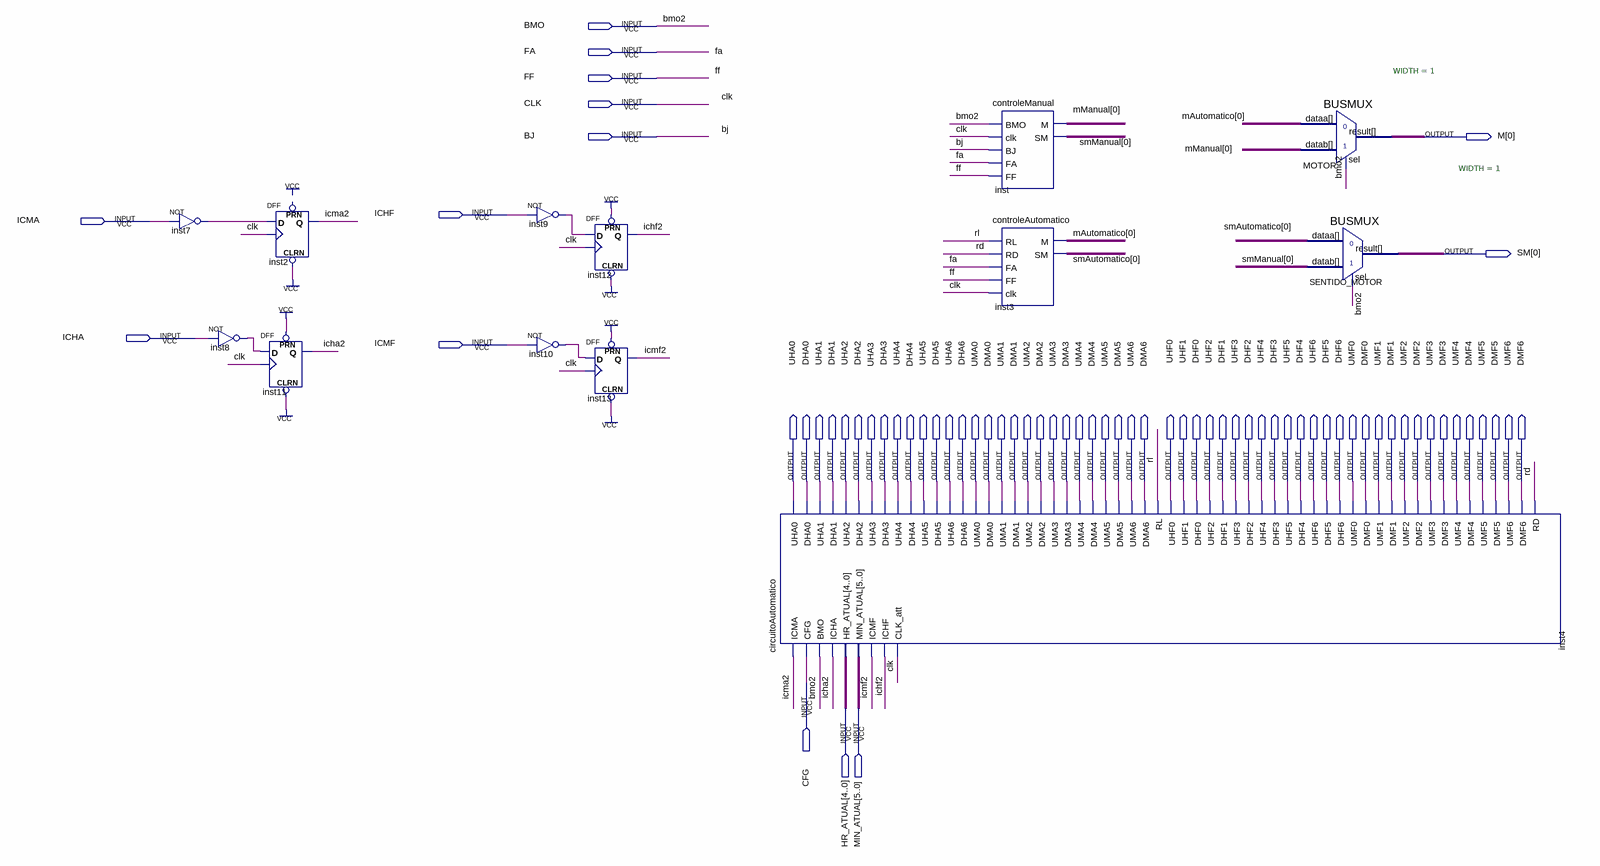
[diagram p0: schematic sheet]
// Quartus schematic Controlador.bdf as structural Verilog: 13 symbols, 70 pins
module Controlador (
  input  BMO,
  input  FA,
  input  FF,
  input  CLK,
  input  BJ,
  input  ICHF,
  input  ICMA,
  input  ICHA,
  input  ICMF,
  input  CFG,
  input  [4:0] HR_ATUAL,
  input  [5:0] MIN_ATUAL,
  output [0:0] M,
  output [0:0] SM,
  output UHA0,
  output DHA0,
  output UHA1,
  output DHA1,
  output UHA2,
  output DHA2,
  output UHA3,
  output DHA3,
  output UHA4,
  output DHA4,
  output UHA5,
  output DHA5,
  output UHA6,
  output DHA6,
  output UMA0,
  output DMA0,
  output UMA1,
  output DMA1,
  output UMA2,
  output DMA2,
  output UMA3,
  output DMA3,
  output UMA4,
  output DMA4,
  output UMA5,
  output DMA5,
  output UMA6,
  output DMA6,
  output UHF0,
  output UHF1,
  output DHF0,
  output UHF2,
  output DHF1,
  output UHF3,
  output DHF2,
  output UHF4,
  output DHF3,
  output UHF5,
  output DHF4,
  output UHF6,
  output DHF5,
  output DHF6,
  output UMF0,
  output DMF0,
  output UMF1,
  output DMF1,
  output UMF2,
  output DMF2,
  output UMF3,
  output DMF3,
  output UMF4,
  output DMF4,
  output UMF5,
  output DMF5,
  output UMF6,
  output DMF6
);

  wire icha2, ichf2, icma2, icmf2, inst7_out, inst8_out, inst9_out, inst10_out, rd, rl;
  wire [0:0] mAutomatico, mManual, smAutomatico, smManual;

  not inst7 (inst7_out, ICMA);
  not inst8 (inst8_out, ICHA);
  DFF inst11 (.CLRN(1'b1), .CLK(CLK), .D(inst8_out), .PRN(1'b1), .Q(icha2));
  DFF inst2 (.CLRN(1'b1), .CLK(CLK), .D(inst7_out), .Q(icma2));  // open: PRN
  not inst9 (inst9_out, ICHF);
  not inst10 (inst10_out, ICMF);
  DFF inst12 (.CLRN(1'b1), .CLK(CLK), .D(inst9_out), .PRN(1'b1), .Q(ichf2));
  DFF inst13 (.CLRN(1'b1), .CLK(CLK), .D(inst10_out), .PRN(1'b1), .Q(icmf2));
  circuitoAutomatico inst4 (
    .BMO(BMO), .CFG(CFG), .CLK_att(CLK), .HR_ATUAL(HR_ATUAL), .ICHA(icha2), .ICHF(ichf2), .ICMA(icma2),
    .ICMF(icmf2), .MIN_ATUAL(MIN_ATUAL), .DHA0(DHA0), .DHA1(DHA1), .DHA2(DHA2), .DHA3(DHA3), .DHA4(DHA4),
    .DHA5(DHA5), .DHA6(DHA6), .DHF0(DHF0), .DHF1(DHF1), .DHF2(DHF2), .DHF3(DHF3), .DHF4(DHF4), .DHF5(DHF5),
    .DHF6(DHF6), .DMA0(DMA0), .DMA1(DMA1), .DMA2(DMA2), .DMA3(DMA3), .DMA4(DMA4), .DMA5(DMA5), .DMA6(DMA6),
    .DMF0(DMF0), .DMF1(DMF1), .DMF2(DMF2), .DMF3(DMF3), .DMF4(DMF4), .DMF5(DMF5), .DMF6(DMF6), .RD(rd),
    .RL(rl), .UHA0(UHA0), .UHA1(UHA1), .UHA2(UHA2), .UHA3(UHA3), .UHA4(UHA4), .UHA5(UHA5), .UHA6(UHA6),
    .UHF0(UHF0), .UHF1(UHF1), .UHF2(UHF2), .UHF3(UHF3), .UHF4(UHF4), .UHF5(UHF5), .UHF6(UHF6), .UMA0(UMA0),
    .UMA1(UMA1), .UMA2(UMA2), .UMA3(UMA3), .UMA4(UMA4), .UMA5(UMA5), .UMA6(UMA6), .UMF0(UMF0), .UMF1(UMF1),
    .UMF2(UMF2), .UMF3(UMF3), .UMF4(UMF4), .UMF5(UMF5), .UMF6(UMF6));
  controleManual inst (.BMO(BMO), .clk(CLK), .BJ(BJ), .FA(FA), .FF(FF), .M(mManual[0]), .SM(smManual[0]));
  controleAutomatico inst3 (.RL(rl), .RD(rd), .FA(FA), .FF(FF), .clk(CLK), .M(mAutomatico[0]), .SM(smAutomatico[0]));
  BUSMUX #(.WIDTH(1)) MOTOR (.datab(mManual[0]), .sel(BMO), .dataa(mAutomatico[0]), .result(M[0]));
  BUSMUX #(.WIDTH(1)) SENTIDO_MOTOR (.datab(smManual[0]), .sel(BMO), .dataa(smAutomatico[0]), .result(SM[0]));

  // Other names for the same wires on the sheet: bmo2 = BMO
endmodule
